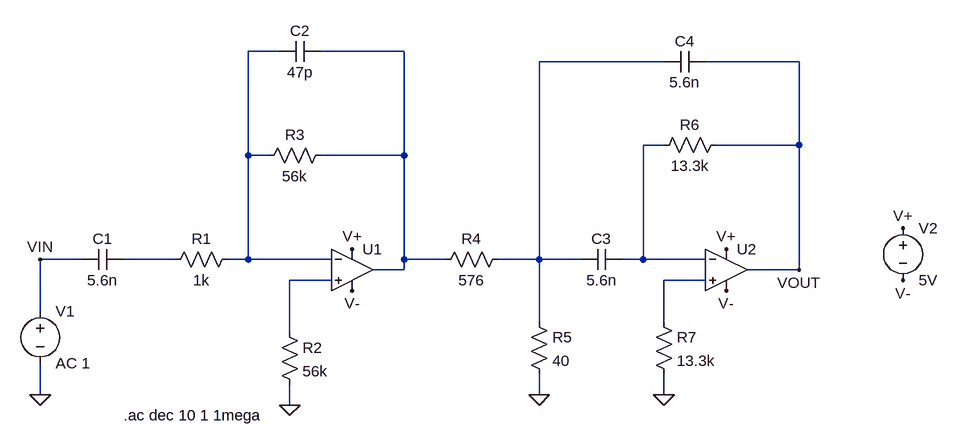
[diagram p0: schematic Draft2.asc]
Draft2.asc, the LTspice schematic file:
Version 4.1
SHEET 1 1016 680
WIRE -64 -144 -112 -144
WIRE 128 -144 0 -144
WIRE 528 -128 336 -128
WIRE 736 -128 592 -128
WIRE 528 0 496 0
WIRE 736 0 736 -128
WIRE 736 0 608 0
WIRE -112 16 -112 -144
WIRE -80 16 -112 16
WIRE 128 16 128 -144
WIRE 128 16 0 16
WIRE -368 176 -432 176
WIRE -224 176 -304 176
WIRE -112 176 -112 16
WIRE -112 176 -144 176
WIRE 16 176 -112 176
WIRE 128 176 128 16
WIRE 192 176 128 176
WIRE 336 176 336 -128
WIRE 336 176 272 176
WIRE 400 176 336 176
WIRE 496 176 496 0
WIRE 496 176 464 176
WIRE 592 176 496 176
WIRE 128 192 128 176
WIRE 128 192 80 192
WIRE 736 192 736 0
WIRE 736 192 656 192
WIRE 16 208 -48 208
WIRE 592 208 528 208
WIRE -432 256 -432 176
WIRE 336 272 336 176
WIRE 528 272 528 208
WIRE -48 288 -48 208
WIRE -432 384 -432 336
WIRE 336 384 336 352
WIRE 528 384 528 352
WIRE -48 400 -48 368
FLAG 336 384 0
FLAG 528 384 0
FLAG -48 400 0
FLAG -432 384 0
FLAG 896 128 V+
FLAG 624 160 V+
FLAG 48 160 V+
FLAG 48 224 V-
FLAG 624 224 V-
FLAG 896 208 V-
FLAG -432 176 VIN
FLAG 736 192 VOUT
SYMBOL OpAmps\\UniversalOpAmp 48 192 R0
SYMATTR InstName U1
SYMBOL OpAmps\\UniversalOpAmp 624 192 R0
SYMATTR InstName U2
SYMBOL res -128 160 R90
WINDOW 0 0 56 VBottom 2
WINDOW 3 32 56 VTop 2
SYMATTR InstName R1
SYMATTR Value 1k
SYMBOL res -64 272 R0
SYMATTR InstName R2
SYMATTR Value 56k
SYMBOL res 16 0 R90
WINDOW 0 0 56 VBottom 2
WINDOW 3 32 56 VTop 2
SYMATTR InstName R3
SYMATTR Value 56k
SYMBOL res 288 160 R90
WINDOW 0 0 56 VBottom 2
WINDOW 3 32 56 VTop 2
SYMATTR InstName R4
SYMATTR Value 576
SYMBOL res 320 256 R0
SYMATTR InstName R5
SYMATTR Value 40
SYMBOL res 624 -16 R90
WINDOW 0 0 56 VBottom 2
WINDOW 3 32 56 VTop 2
SYMATTR InstName R6
SYMATTR Value 13.3k
SYMBOL res 512 256 R0
SYMATTR InstName R7
SYMATTR Value 13.3k
SYMBOL cap -304 160 R90
WINDOW 0 0 32 VBottom 2
WINDOW 3 32 32 VTop 2
SYMATTR InstName C1
SYMATTR Value 5.6n
SYMBOL cap -64 -128 R270
WINDOW 0 32 32 VTop 2
WINDOW 3 0 32 VBottom 2
SYMATTR InstName C2
SYMATTR Value 47p
SYMBOL cap 400 192 R270
WINDOW 0 32 32 VTop 2
WINDOW 3 0 32 VBottom 2
SYMATTR InstName C3
SYMATTR Value 5.6n
SYMBOL cap 528 -112 R270
WINDOW 0 32 32 VTop 2
WINDOW 3 0 32 VBottom 2
SYMATTR InstName C4
SYMATTR Value 5.6n
SYMBOL voltage -432 240 R0
SYMATTR InstName V1
SYMATTR Value AC 1
SYMBOL voltage 896 112 R0
SYMATTR InstName V2
SYMATTR Value 5V
TEXT -304 416 Left 2 !.ac dec 10 1 1mega

The netlist it stands for:
* Draft2.asc
X§U1 N006 N001 V+ V- N002 level1 Avol=1Meg GBW=10Meg Vos=0 En=0 Enk=0 In=0 Ink=0 Rin=500Meg  ; pins In+ In- V+ V- OUT
X§U2 N007 N004 V+ V- VOUT level1 Avol=1Meg GBW=10Meg Vos=0 En=0 Enk=0 In=0 Ink=0 Rin=500Meg  ; pins In+ In- V+ V- OUT
R1 N001 N005 1k
R2 N006 0 56k
R3 N002 N001 56k
R4 N003 N002 576
R5 N003 0 40
R6 VOUT N004 13.3k
R7 N007 0 13.3k
C1 N005 VIN 5.6n
C2 N001 N002 47p
C3 N003 N004 5.6n
C4 N003 VOUT 5.6n
V1 VIN 0 AC 1
V2 V+ V- 5V
.ac dec 10 1 1mega
.lib UniversalOpAmp1.lib
.backanno
.end